# EasyEDA schematic 1-Schematic_biz-card.json
TITLE: PCB Business Card; REV: 1.0; Date: 2024-04-20; Sheet: 1/1; Drawn By: Nam; Company: Personal
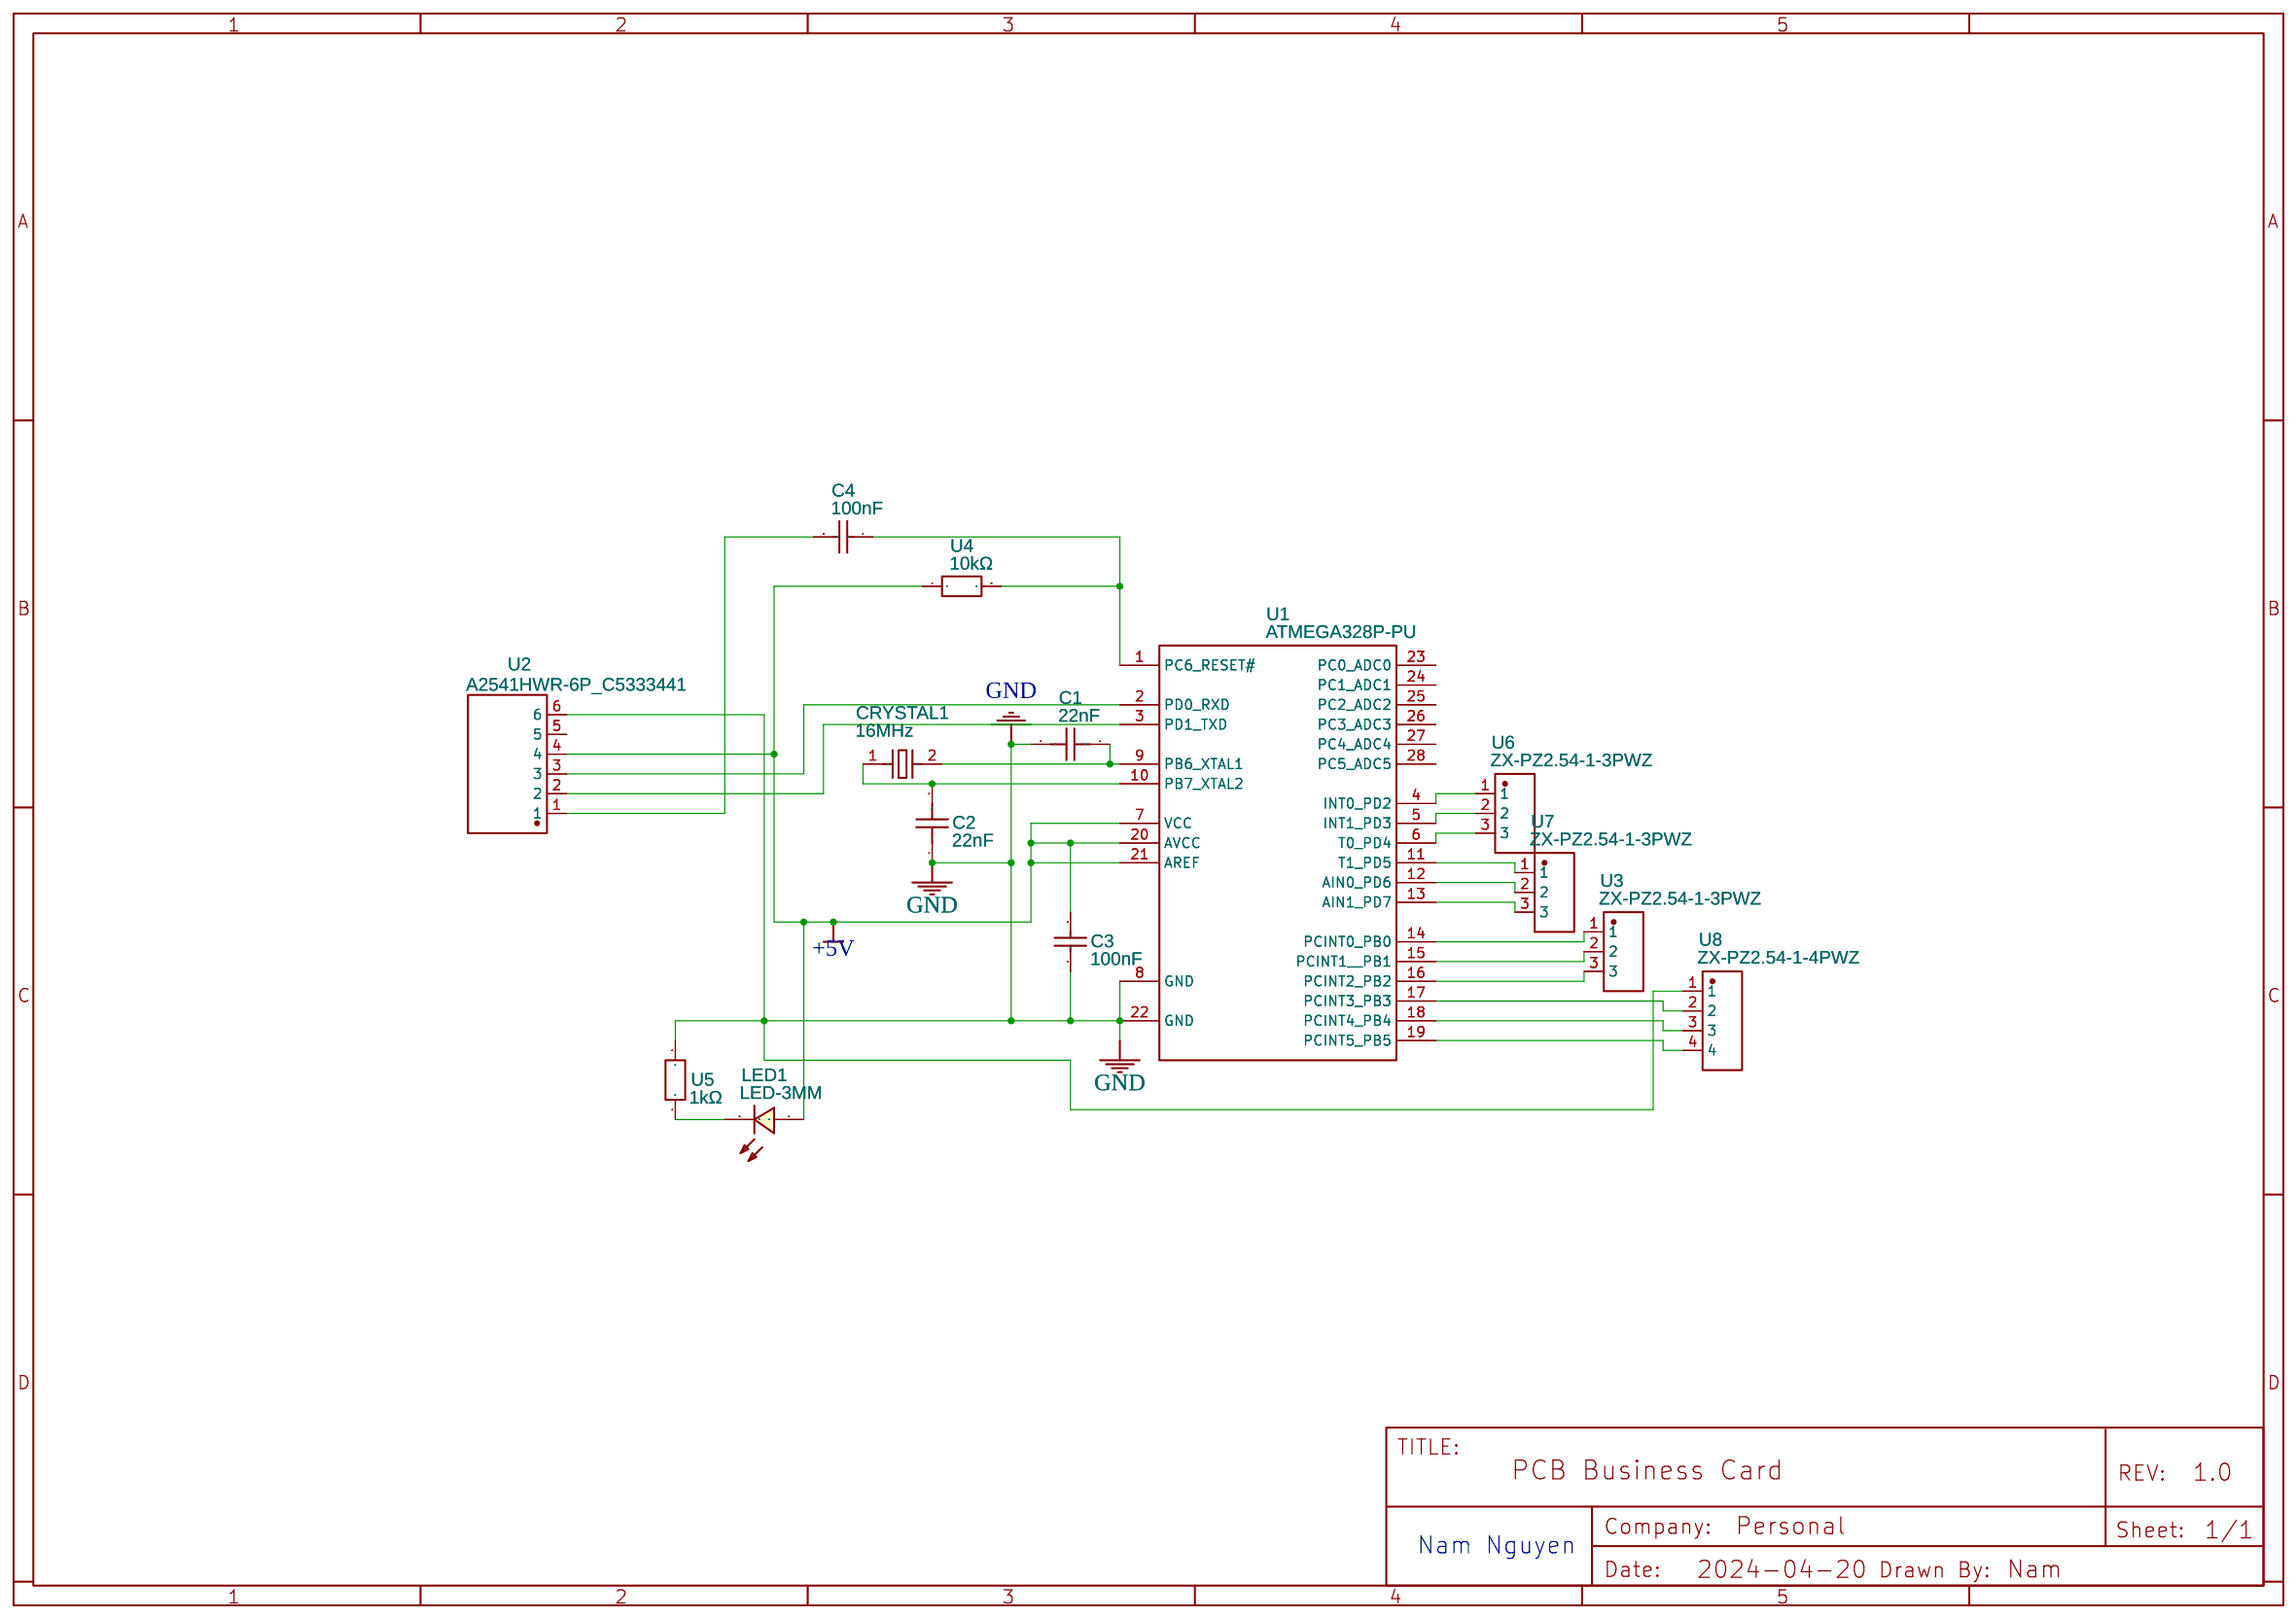
[diagram p0: schematic sheet]

## Parts
C1  22nF  [CAP-TH_L5.0-W2.5-P5.08-D0.7]
C2  22nF  [CAP-TH_L5.0-W2.5-P5.08-D0.7]
C3  100nF  [CAP-TH_L4.9-W3.7-P5.08-D0.5]
C4  100nF  [CAP-TH_L4.9-W3.7-P5.08-D0.5]
CRYSTAL1  16MHz  [CRYSTAL-TH_L10.8-W4.5-P4.88]
LED1  LED-3MM  [LED-TH_LED-3MM_RED]
U1  ATMEGA328P-PU  [DIP-28_L34.6-W7.3-P2.54-LS10.2-BL]
U2  A2541HWR-6P_C5333441  [HDR-TH_6P-P2.54_CJT_A2541HWR-6P]
U3  ZX-PZ2.54-1-3PWZ  [HDR-TH_3P-P2.54-H-M-W10.4-N]
U4  10kΩ  [RES-TH_BD2.4-L6.0-P10.00-D0.6]
U5  1kΩ  [RES-TH_BD2.5-L6.5-P10.50-D0.6]
U6  ZX-PZ2.54-1-3PWZ  [HDR-TH_3P-P2.54-H-M-W10.4-N]
U7  ZX-PZ2.54-1-3PWZ  [HDR-TH_3P-P2.54-H-M-W10.4-N]
U8  ZX-PZ2.54-1-4PWZ  [HDR-TH_4P-P2.54-H-M-W10.3]

## Library data of the parts
C1 C2 = CC1H223ZC1SD3F4D30MF: Contributor: LCSC; Supplier: LCSC; Supplier Part: C254099; Manufacturer: Dersonic(德尔创); JLCPCB Part Class: Extended Part
C3 C4 = 100nF: Supplier: LCSC; Manufacturer: null; Manufacturer Part: 0.1UF(104) +-20% 63v; Supplier Part: C19355; JLCPCB Part Class: Extended Part
CRYSTAL1 = SP2016M00020001: Supplier: LCSC; Supplier Part: C7294721; Manufacturer: HUAXIN(华昕); Contributor: lcsc
LED1 = LED-3MM红: Contributor: LCSC; Supplier: LCSC; Supplier Part: C9900003389; Manufacturer Part: LED-3mm红; Manufacturer: null
U1 = ATMEGA328P-PU: sourceId: Oic6oiASL; Contributor: LCSC; Supplier: LCSC; Manufacturer: MICROCHIP(美国微芯); Supplier Part: C33901; JLCPCB Part Class: Extended Part
U2 = A2541HWR-6P_C5333441: Contributor: lcsc; Supplier: LCSC; Supplier Part: C5333441; Manufacturer: CJT(长江连接器); Manufacturer Part: A2541HWR-6P; JLCPCB Part Class: Extended Part
U3 U6 U7 = ZX-PZ2.54-1-3PWZ: Supplier: LCSC; Supplier Part: C7501291; Manufacturer: Megastar(兆星); Contributor: lcsc; JLCPCB Part Class: Extended Part
U4 = RNS1FTD10K0: Contributor: lcsc; Supplier: LCSC; Supplier Part: C2590358; Manufacturer: SEI(Stackpole Electronics Inc.)
U5 = MRS25000C1001FCT00: Contributor: lcsc; Supplier: LCSC; Supplier Part: C2979794; Manufacturer: VISHAY(威世); JLCPCB Part Class: Extended Part
U8 = ZX-PZ2.54-1-4PWZ: Supplier: LCSC; Supplier Part: C7501292; Manufacturer: Megastar(兆星); Contributor: lcsc; JLCPCB Part Class: Extended Part

## Nets
+5V: C3.2 LED1.1 U1.7(VCC) U1.20(AVCC) U1.21(AREF) U2.4 U4.1
GND: C1.2 C2.1 C3.1 U1.8(GND) U1.22(GND) U2.6 U5.2 U8.1
Net-(C1-1): C1.1 CRYSTAL1.2 U1.9(PB6 XTAL1)
Net-(C2-2): C2.2 CRYSTAL1.1 U1.10(PB7 XTAL2)
Net-(C4-1): C4.1 U1.1(PC6 RESET#) U4.2
Net-(C4-2): C4.2 U2.1
Net-(LED1-2): LED1.2 U5.1
Net-(U1-2): U1.2(PD0 RXD) U2.3
Net-(U1-3): U1.3(PD1 TXD) U2.2
Net-(U1-4): U1.4(INT0 PD2) U6.1
Net-(U1-5): U1.5(INT1 PD3) U6.2
Net-(U1-6): U1.6(T0 PD4) U6.3
Net-(U1-11): U1.11(T1 PD5) U7.1
Net-(U1-12): U1.12(AIN0 PD6) U7.2
Net-(U1-13): U1.13(AIN1 PD7) U7.3
Net-(U1-14): U1.14(PCINT0 PB0) U3.1
Net-(U1-15): U1.15(PCINT1  PB1) U3.2
Net-(U1-16): U1.16(PCINT2 PB2) U3.3
Net-(U1-17): U1.17(PCINT3 PB3) U8.2
Net-(U1-18): U1.18(PCINT4 PB4) U8.3
Net-(U1-19): U1.19(PCINT5 PB5) U8.4

Not connected (* = marked no-connect by the designer): U1 23(PC0 ADC0) 24(PC1 ADC1) 25(PC2 ADC2) 26(PC3 ADC3) 27(PC4 ADC4) 28(PC5 ADC5); U2 5

## Notes on the sheet
- Nam Nguyen
